# EasyEDA Pro project devboard.epro, board Cartridge
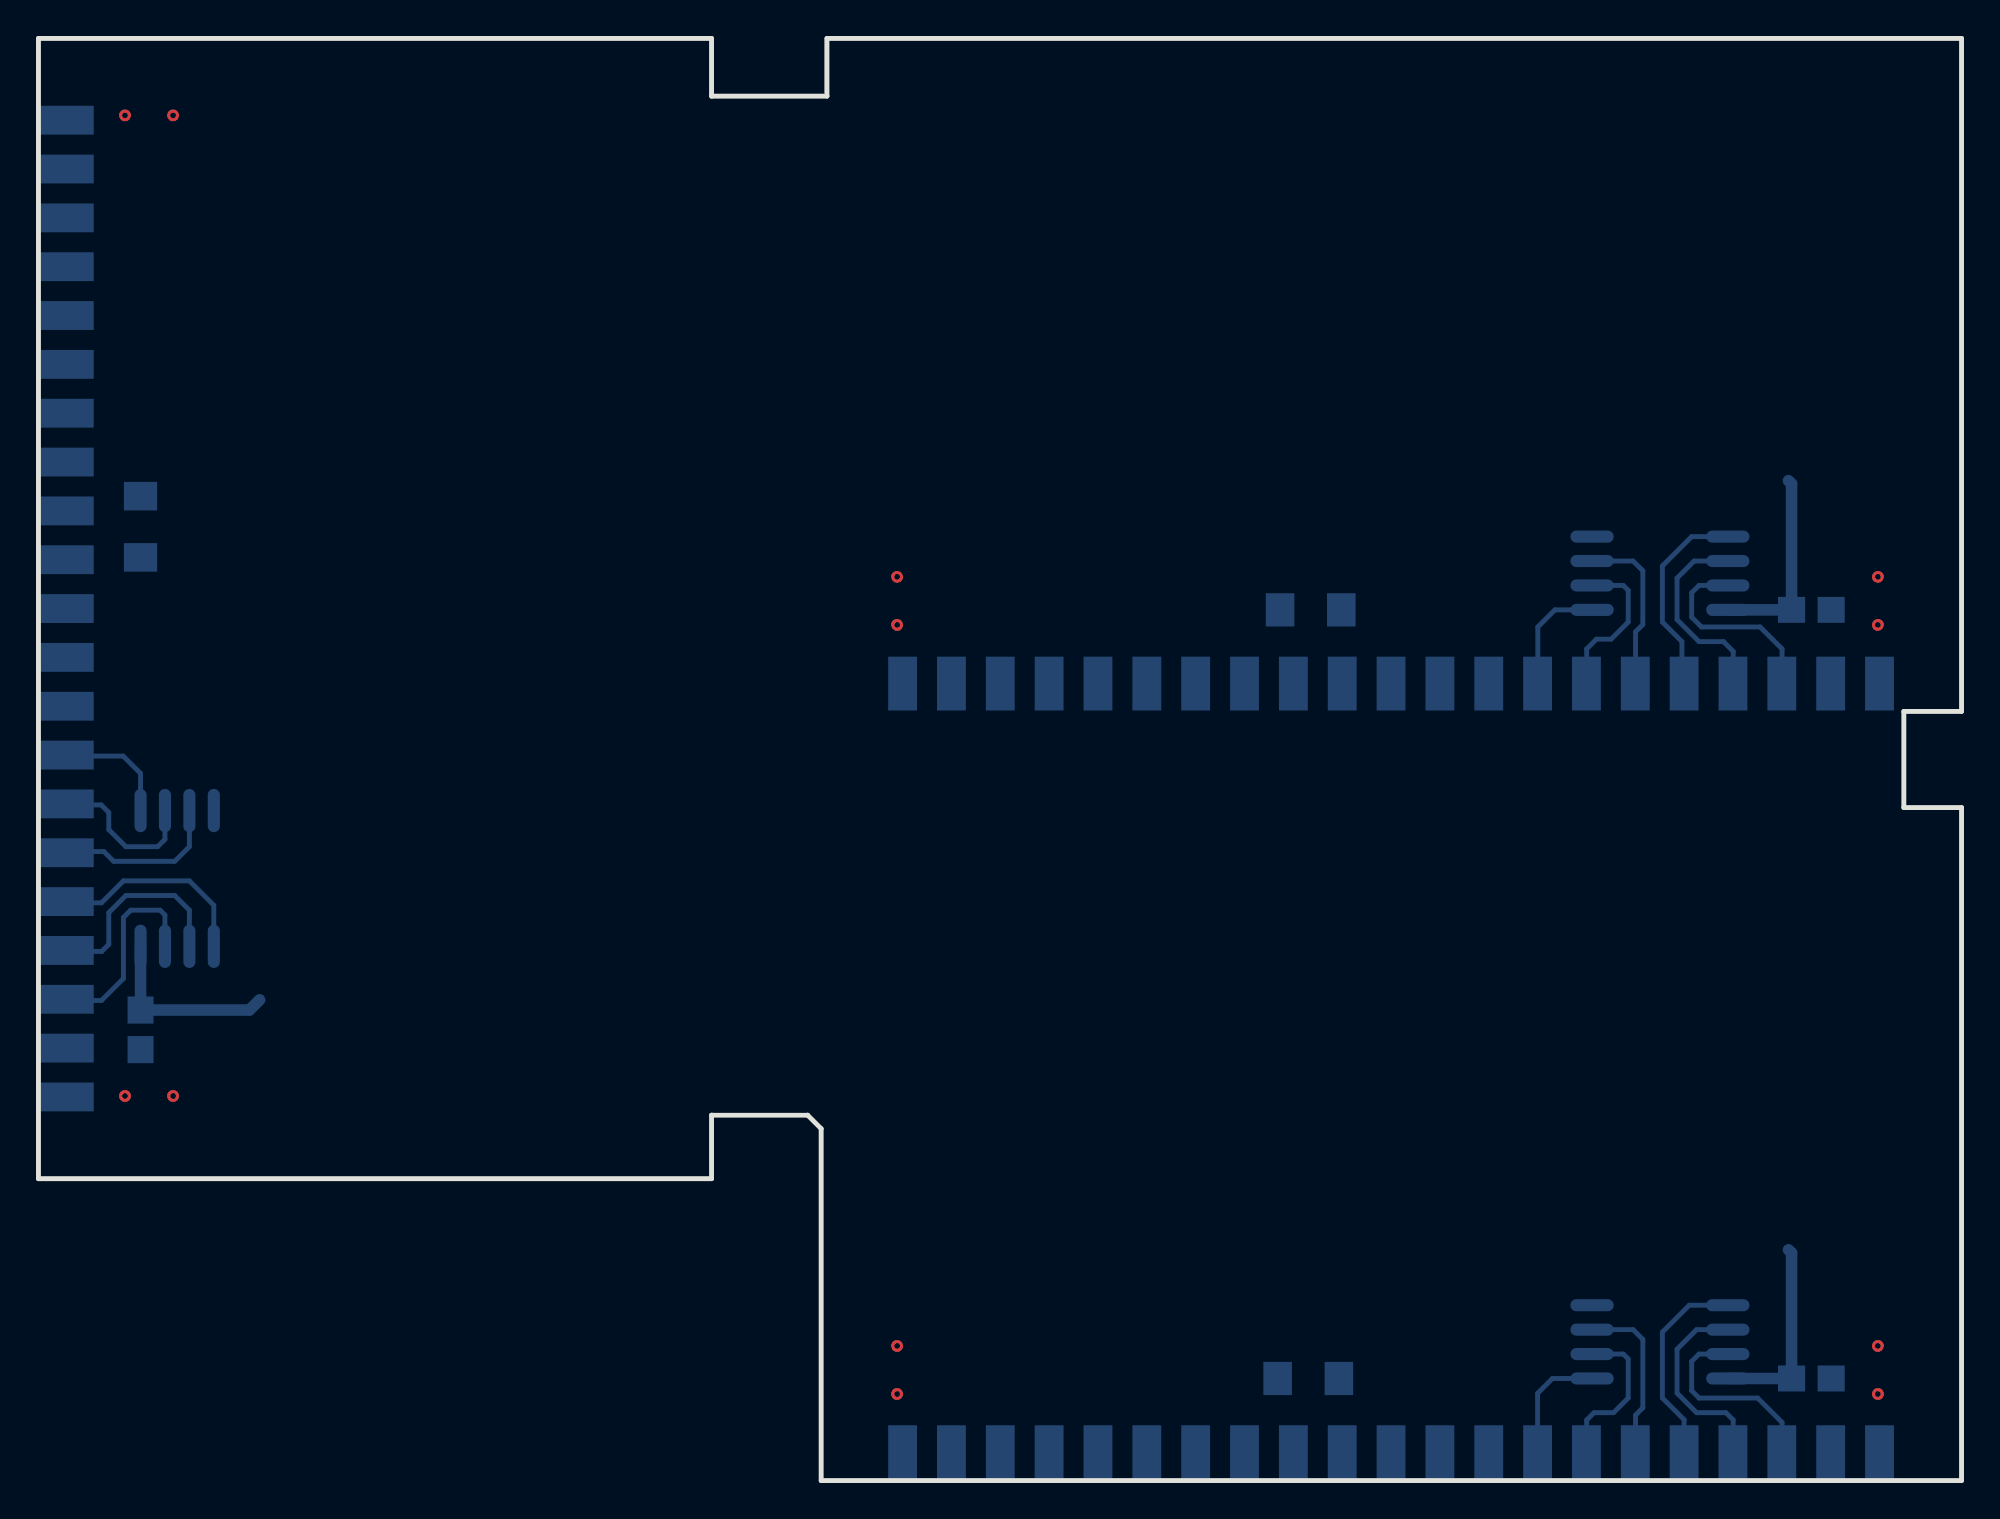
[diagram p17: board, top side]
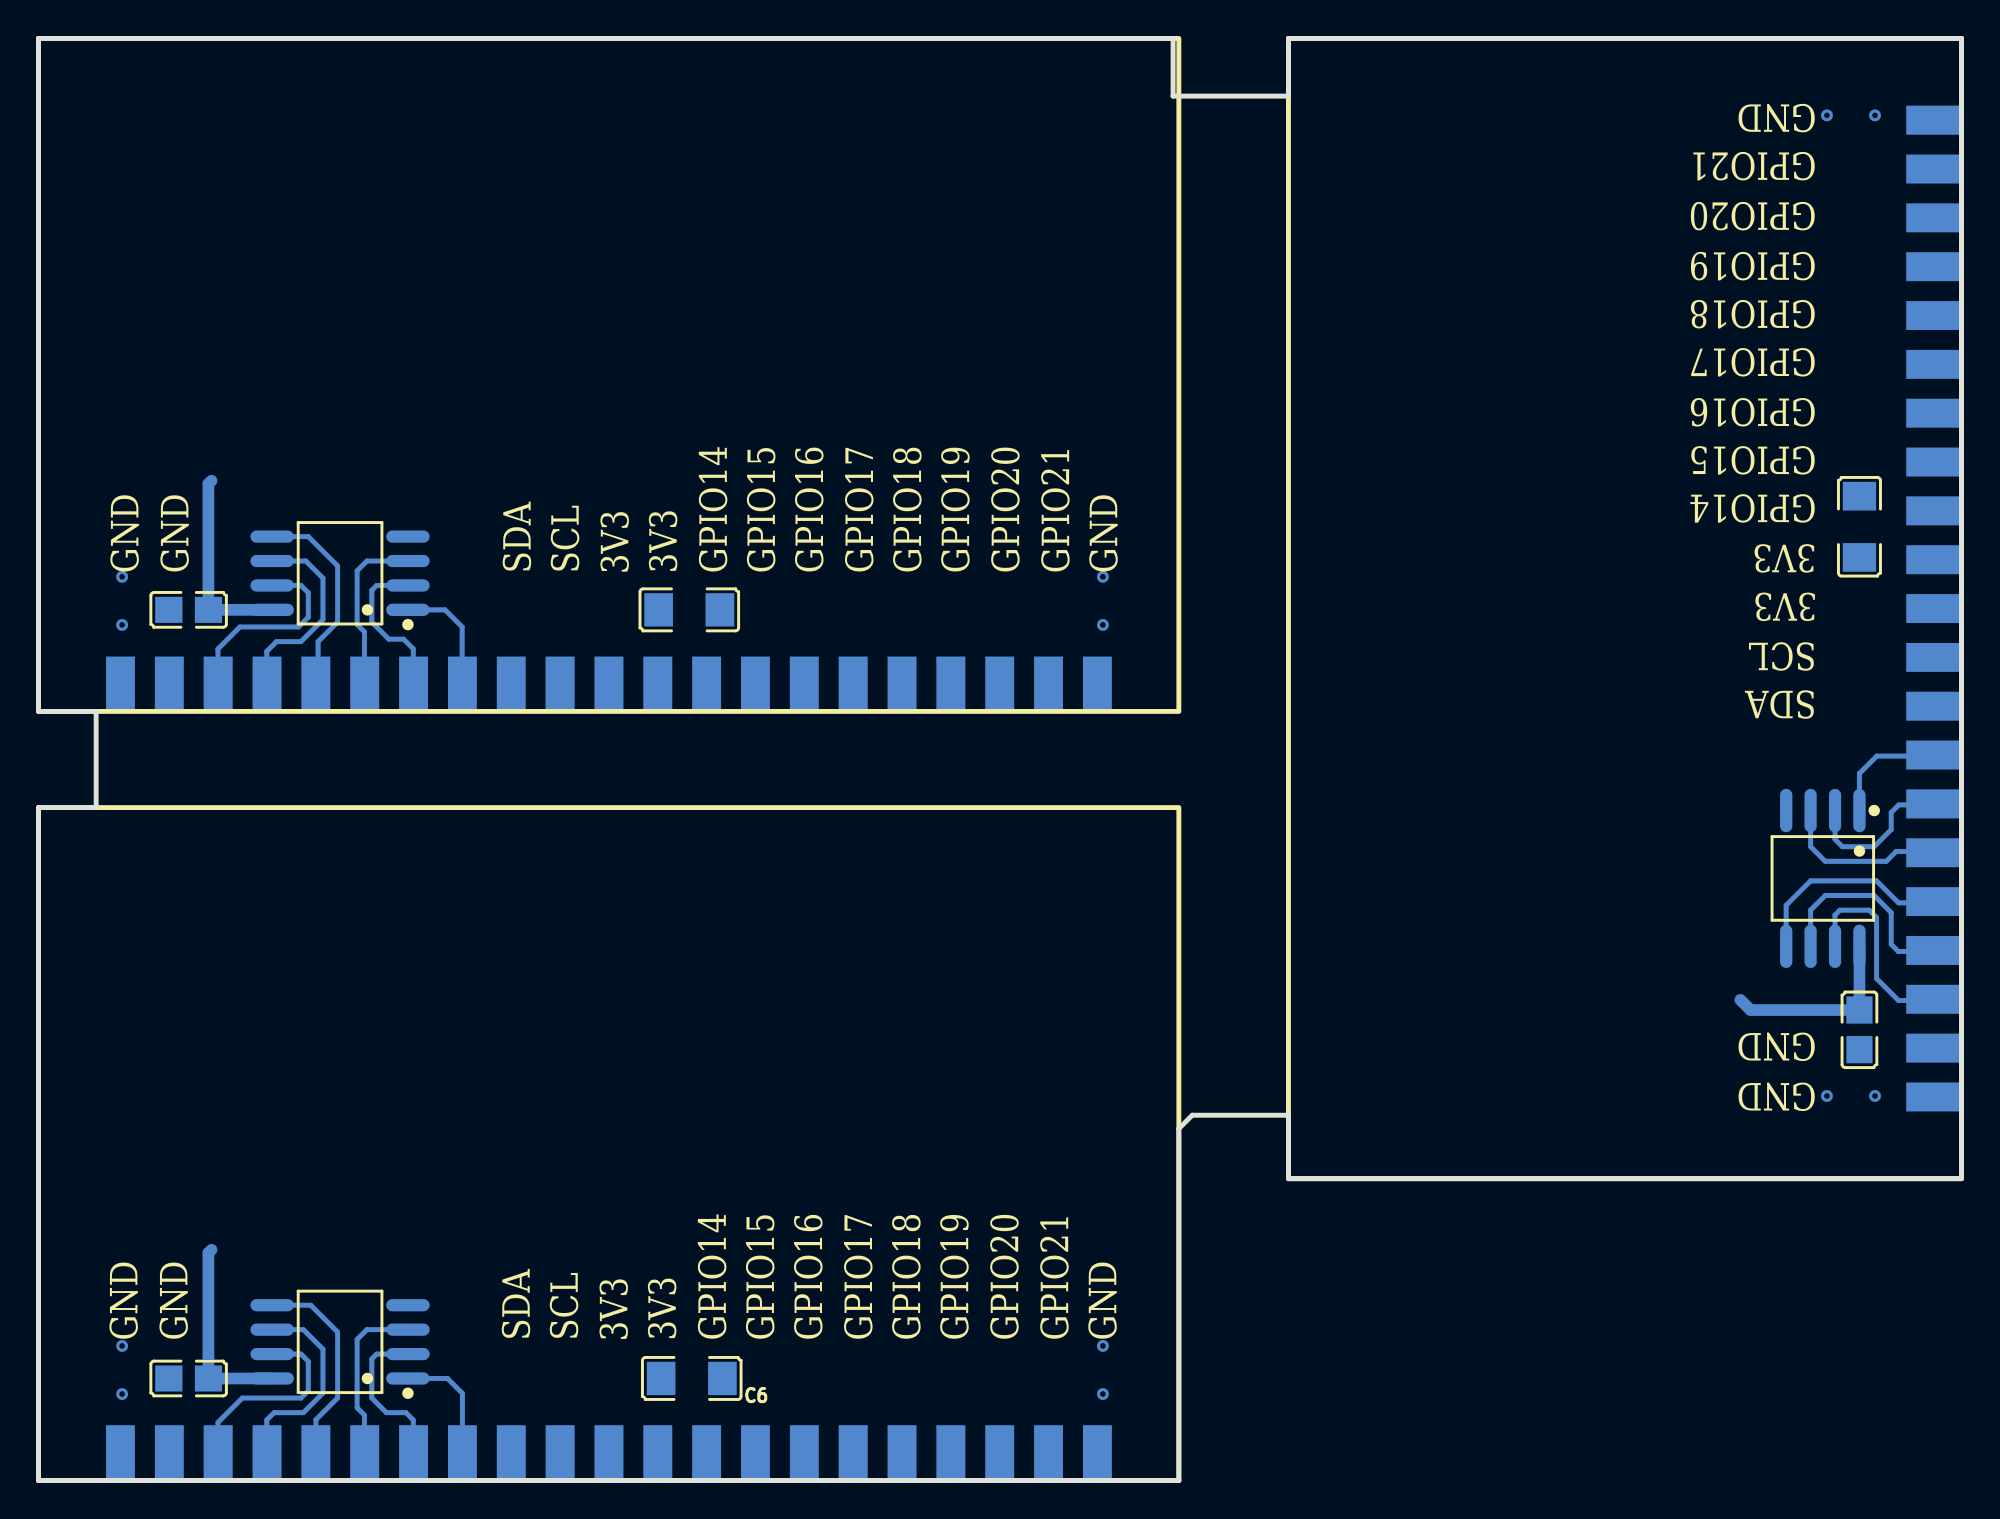
[diagram p18: board, bottom side, seen from below]

Outline 100 x 75 mm; copper layers: Top Layer, Bottom Layer. Coordinates in mm from the lower left corner of the outline.
Outline path: 0,75 35,75 35,72 41,72 41,75 100,75 100,40 97,40 97,35 100,35 100,0 40.7,0 40.7,18.3 40,19 35,19 35,15.7 0,15.7 0,75
Stack: Top Layer 0.035mm / Dielectric1 1.51mm FR4 er 4.5 / Bottom Layer 0.035mm

## Design rules (mm)
template: JLCPCB Capability(Two Layers Board)
spacing copperThickness1oz (default): track to track 0.102, other pairs 0.152 to 0.3
spacing copperThickness2oz: track to track 0.203, other pairs 0.152 to 0.3
track width copperThickness1oz (default): min 0.127, default 0.254, max 2.54
track width copperThickness2oz: min 0.203, default 0.254, max 2.54
differential pair differentialPair (default): width min 0.127, default 0.254, max 2.54; gap min 0.152, default 0.152
via viaSize (default): diameter min 0.5, default 0.61, max 10; hole min 0.3, default 0.305, max 6.3

## Placement (name value [footprint] x y rotation side)
C5  100nF  [C0805]  92.19 5.31 180 bottom
C6  100uF  [C1206]  66.03 5.31 0 bottom
C7  100nF  [C0805]  92.19 45.28 180 bottom
C8  100uF  [C1206]  66.16 45.28 0 bottom
C9  100nF  [C0805]  5.31 23.44 90 bottom
C10  100uF  [C1206]  5.31 49.6 270 bottom
CONN1  -  [RCKid Cartridge Pins]  70.33 1.47 0 bottom
CONN2  -  [RCKid Cartridge Pins]  70.34 41.45 0 bottom
CONN3  -  [RCKid Cartridge Pins]  1.47 45.35 270 bottom
U3  W25Q128JVSIQTR -YJLTY  [SOIC-8_L5.3-W5.3-P1.27-LS8.0-BL]  84.32 7.21 90 bottom
U4  W25Q128JVSIQTR -YJLTY  [SOIC-8_L5.3-W5.3-P1.27-LS8.0-BL]  84.32 47.19 90 bottom
U5  W25Q128JVSIQTR -YJLTY  [SOIC-8_L5.3-W5.3-P1.27-LS8.0-BL]  7.21 31.32 0 bottom

## Footprints (pads in the part's own frame, mm; a bottom-side part is the same pattern mirrored in y, then rotated)
C0805
  rect 1.41x1.35 smd: 1(-1.03,0) 2(1.03,0)
C1206
  rect 1.485x1.728 smd: 1(-1.593,0) 2(1.593,0)
RCKid Cartridge Pins
  rect 1.5x2.8 smd: 1(-25.4,0) 2(-22.86,0) 3(-20.32,0) 4(-17.78,0) 5(-15.24,0) 6(-12.7,0) 7(-10.16,0) 8(-7.62,0) 9(-5.08,0) 10(-2.54,0) 11(0,0) 12(2.54,0) 13(5.08,0) 14(7.62,0) 15(10.16,0) 16(12.7,0) 17(15.24,0) 18(17.78,0) 19(20.32,0) 20(22.86,0) 21(25.4,0)
SOIC-8_L5.3-W5.3-P1.27-LS8.0-BL
  oval 0.63x2.25 smd: 1(-1.905,-3.53) 2(-0.635,-3.53) 3(0.635,-3.53) 4(1.905,-3.53) 5(1.905,3.53) 6(0.635,3.53) 7(-0.635,3.53) 8(-1.905,3.53)

## Nets
As in the schematic.

Pads without a net: CONN1 1 2 3 4 5 6 7 8 9 12 13; CONN2 1 2 3 4 5 6 7 8 9 12 13; CONN3 1 2 3 4 5 6 7 8 9 12 13

## Via types
v1: diameter 0.61, hole 0.305, Top Layer to Bottom Layer, 12 vias

## Routing (per net, layer and track width the routed paths; a pad name or vN(x,y) marks a point on that pad's centre or on a via; arc(x,y) is an arc through that point)
3V3: length 29.9
  Bottom Layer w0.6: 11.5,25 10.97,24.47 C9.2 U5.8 ; U3.8 C5.2 91.16,11.84 91,12 ; 91,52 91.16,51.84 C7.2 U4.8
GND:
  vias: v1(4.5,71) v1(4.5,20) v1(7,71) v1(7,20) v1(44.65,47) v1(44.65,44.5) v1(44.65,7) v1(44.65,4.5) v1(95.65,47) v1(95.65,44.5) v1(95.65,7) v1(95.65,4.5)
QSPI_SCLK: length 31.7
  Bottom Layer w0.254: 1.47,27.52 3.29,27.52 3.66,27.89 3.66,29.54 4.55,30.43 7.09,30.43 7.85,29.66 U5.6 ; U4.6 86.09,47.82 85.21,46.93 85.21,44.77 86.35,43.63 87.62,43.63 88.13,43.12 88.13,41.46 CONN2.18 ; U3.6 86.22,7.85 85.21,6.83 85.21,4.55 86.22,3.53 87.75,3.53 88.13,3.15 88.13,1.49 CONN1.18
QSPI_SD0: length 32.1
  Bottom Layer w0.254: U4.5 85.97,49.09 84.44,47.57 84.44,44.65 85.46,43.63 85.46,41.56 CONN2.17 ; U3.5 85.84,9.12 84.44,7.72 84.44,4.29 85.57,3.16 CONN1.17 ; 1.47,30.06 1.49,30.05 3.28,30.05 4.42,31.19 7.85,31.19 9.12,29.92 U5.5
QSPI_SD1: length 24.7
  Bottom Layer w0.254: 1.47,35.14 3.26,35.14 3.66,34.74 3.66,33.86 4.55,32.97 6.2,32.97 6.58,33.35 U5.2 ; CONN2.15 80.51,41.46 80.51,43.25 81.02,43.76 81.78,43.76 82.67,44.65 82.67,46.3 82.41,46.55 U4.2 ; U3.2 82.41,6.58 82.67,6.32 82.67,4.29 81.9,3.53 80.89,3.53 80.51,3.15 80.51,1.49 CONN1.15
QSPI_SD2: length 26.6
  Bottom Layer w0.254: CONN1.16 83.05,1.49 83.05,3.4 83.43,3.78 83.43,7.34 82.92,7.85 U3.3 ; U4.3 82.92,47.82 83.43,47.31 83.43,44.52 83.05,44.14 83.05,41.46 CONN2.16 ; 1.47,32.6 1.59,32.71 3.4,32.71 3.91,32.2 7.09,32.2 7.85,32.97 U5.3
QSPI_SD3: length 31.6
  Bottom Layer w0.254: U5.7 6.58,29.41 6.32,29.66 4.8,29.66 4.42,29.28 4.42,26.11 3.28,24.97 1.49,24.97 1.47,24.98 ; CONN2.19 90.67,41.46 90.67,43.25 89.52,44.39 86.48,44.39 85.97,44.9 85.97,46.17 86.35,46.55 U4.7 ; CONN1.19 90.67,1.49 90.67,3.02 89.4,4.29 86.35,4.29 85.97,4.67 85.97,6.2 86.35,6.58 U3.7
QSPI_SS: length 18.5
  Bottom Layer w0.254: U3.1 78.73,5.31 77.95,4.53 CONN1.14 ; U4.1 78.86,45.28 77.97,44.39 77.97,41.46 CONN2.14 ; U5.1 5.31,36.78 4.41,37.68 1.47,37.68

## Copper pours and planes (outline as drawn; the poured copper is in the pictures)
3V3 on Bottom Layer: 66.5,40 66.5,51 69.5,54 91.5,54 92.5,53 92.5,51 92,50.5 73.5,50.5 72,49 72,40
3V3 on Bottom Layer: 0,49.5 11,49.5 14,46.5 14,24.5 13,23.5 11,23.5 10.5,24 10.5,42.5 9,44 0,44
3V3 on Bottom Layer: 66.5,0 66.5,11 69.5,14 91.5,14 92.5,13 92.5,11 92,10.5 73.5,10.5 72,9 72,0
GND on Top Layer: 40.65,0 40.65,35 99.95,35 99.95,0
GND on Top Layer: 0,75 35,75 35,15.7 0,15.7
GND on Top Layer: 40.65,40 40.65,75 99.95,75 99.95,40
GND on Bottom Layer: 40.7,75 100,75 100,40 40.7,40
GND on Bottom Layer: 40.7,35 100,35 100,0 40.7,0
GND on Bottom Layer: 0,75 35,75 35,15.7 0,15.7

## Text on the board
Bottom Silkscreen Layer: GND | GPIO21 | GPIO20 | GPIO19 | GPIO18 | GPIO17 | GPIO16 | GPIO15 | GPIO14 | 3V3 | SCL | SDA
